# Altium schematic sheet B车模摄像头.SchDoc
size A4
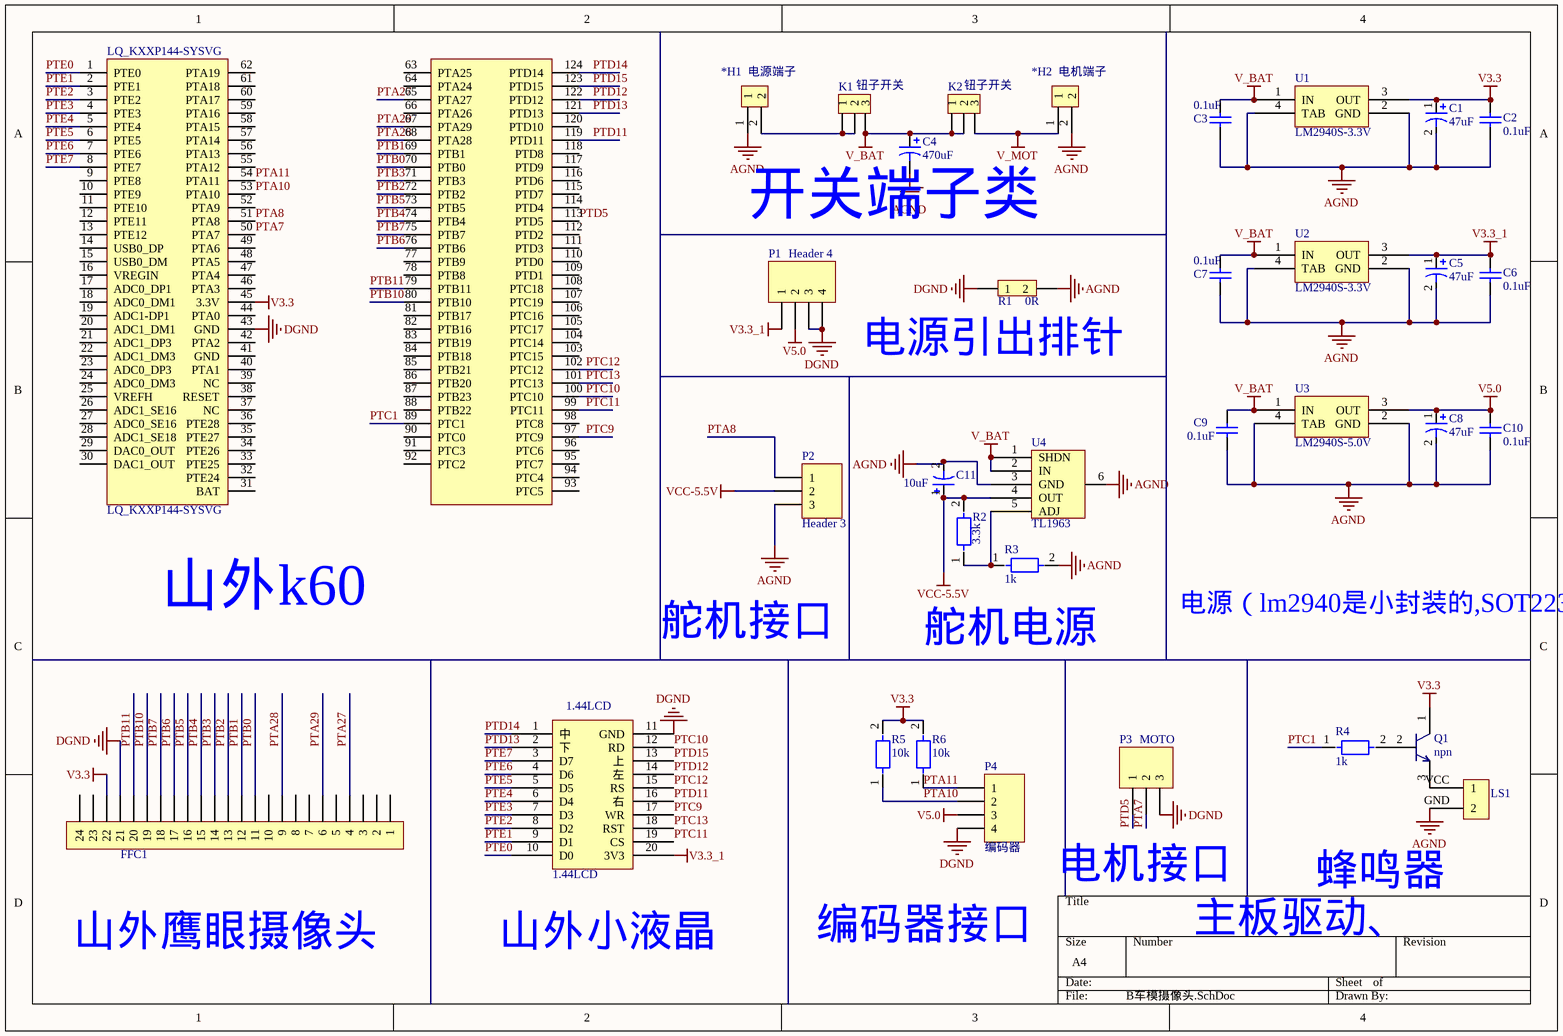
[diagram p0: B车模摄像头.SchDoc]

## Parts
1.44LCD  1.44LCD  [1.44LCD]
*H1  电源端子  [端子]
*H2  电机端子  [端子]
C1  47uF  [3216]
C2  0.1uF  [0805]
C3  0.1uF  [0805]
C4  value 470uF  [470UF]  (hidden comment: Cap Pol1)
C5  47uF  [3216]
C6  0.1uF  [0805]
C7  0.1uF  [0805]
C8  47uF  [3216]
C9  0.1uF  [0805]
C10  0.1uF  [0805]
C11  10uF  [3216]
FFC1  FFC_0.5_24  [摄像头软排]  (value not drawn)
K1  钮子开关  [钮子开关]
K2  钮子开关  [钮子开关]
LQ_KXXP144-SYSVG  LQ_KXXP144-SYSVG  [LQ_KXXP144-SYSVG]
LS1  0905小型蜂鸣器  [0905小型蜂鸣器]  (value not drawn)
P1  Header 4  [HDR1X4]
P2  Header 3  [HDR1X3]
P3  MOTO  [HDR1X3]
P4  编码器  [HDR1X4]
Q1  npn  [npn]
R1  vaul: 0R  [R-0603 - duplicate1]  (hidden comment: R-0603)
R2  3.3k  [0805]
R3  1k  [0805]
R4  1k  [0805]
R5  10k  [0805]
R6  10k  [0805]
U1  LM2940S-3.3V  [LM2940S-5.0]
U2  LM2940S-3.3V  [LM2940S-5.0]
U3  LM2940S-5.0V  [LM2940S-5.0]
U4  TL1963  [SOT223-5]

## Nets
AGND: *H1.1 *H2.2 C1.2 C2.2 C3.2 C4.2 C5.2 C6.2 C7.2 C8.2 C9.2 C10.2 C11.2 LS1.GND(2) P2.3 R1.3(2) R3.2 U1.2(GND) U1.4(TAB) U2.2(GND) U2.4(TAB) U3.2(GND) U3.4(TAB) U4.3(GND) U4.6(GND)
DGND: 1.44LCD.11(GND) FFC1.21 LQ_KXXP144-SYSVG.43(GND) P1.3 P1.4 P3.3 P4.4 R1.2(1)
V3.3: C1.1 C2.1 FFC1.22 LQ_KXXP144-SYSVG.45(3.3V) Q1.1 R5.2 R6.2 U1.3(OUT)
V3.3_1: 1.44LCD.20(3V3) C5.1 C6.1 P1.1 U2.3(OUT)
V5.0: C8.1 C10.1 P1.2 P4.3 U3.3(OUT)
V_BAT: C3.1 C4.1 C7.1 C9.1 K1.3 K2.1 K2.2 U1.1(IN) U2.1(IN) U3.1(IN) U4.1(SHDN) U4.2(IN)
V_MOT: *H2.1 K2.3
VCC-5.5V: C11.1 P2.2 R2.2 U4.4(OUT)
PTA7: LQ_KXXP144-SYSVG.50(PTA7) P3.2
PTA8: LQ_KXXP144-SYSVG.51(PTA8) P2.1
PTA10: LQ_KXXP144-SYSVG.53(PTA10) P4.2 R5.1
PTA11: LQ_KXXP144-SYSVG.54(PTA11) P4.1 R6.1
PTA27: FFC1.4 LQ_KXXP144-SYSVG.65(PTA27)
PTA28: FFC1.9 LQ_KXXP144-SYSVG.68(PTA28)
PTA29: FFC1.6 LQ_KXXP144-SYSVG.67(PTA29)
PTB0: FFC1.11 LQ_KXXP144-SYSVG.70(PTB0)
PTB1: FFC1.12 LQ_KXXP144-SYSVG.69(PTB1)
PTB2: FFC1.13 LQ_KXXP144-SYSVG.72(PTB2)
PTB3: FFC1.14 LQ_KXXP144-SYSVG.71(PTB3)
PTB4: FFC1.15 LQ_KXXP144-SYSVG.74(PTB4)
PTB5: FFC1.16 LQ_KXXP144-SYSVG.73(PTB5)
PTB6: FFC1.17 LQ_KXXP144-SYSVG.76(PTB6)
PTB7: FFC1.18 LQ_KXXP144-SYSVG.75(PTB7)
PTB10: FFC1.19 LQ_KXXP144-SYSVG.80(PTB10)
PTB11: FFC1.20 LQ_KXXP144-SYSVG.79(PTB11)
PTC1: LQ_KXXP144-SYSVG.89(PTC1) R4.1
PTC9: 1.44LCD.17(WR) LQ_KXXP144-SYSVG.97(PTC9)
PTC10: 1.44LCD.12(RD) LQ_KXXP144-SYSVG.100(PTC10)
PTC11: 1.44LCD.19(CS) LQ_KXXP144-SYSVG.99(PTC11)
PTC12: 1.44LCD.15(RS) LQ_KXXP144-SYSVG.102(PTC12)
PTC13: 1.44LCD.18(RST) LQ_KXXP144-SYSVG.101(PTC13)
PTD5: LQ_KXXP144-SYSVG.113(PTD5) P3.1
PTD11: 1.44LCD.16(右) LQ_KXXP144-SYSVG.119(PTD11)
PTD12: 1.44LCD.14(左) LQ_KXXP144-SYSVG.122(PTD12)
PTD13: 1.44LCD.2(下) LQ_KXXP144-SYSVG.121(PTD13)
PTD14: 1.44LCD.1(中) LQ_KXXP144-SYSVG.124(PTD14)
PTD15: 1.44LCD.13(上) LQ_KXXP144-SYSVG.123(PTD15)
PTE0: 1.44LCD.10(D0) LQ_KXXP144-SYSVG.1(PTE0)
PTE1: 1.44LCD.9(D1) LQ_KXXP144-SYSVG.2(PTE1)
PTE2: 1.44LCD.8(D2) LQ_KXXP144-SYSVG.3(PTE2)
PTE3: 1.44LCD.7(D3) LQ_KXXP144-SYSVG.4(PTE3)
PTE4: 1.44LCD.6(D4) LQ_KXXP144-SYSVG.5(PTE4)
PTE5: 1.44LCD.5(D5) LQ_KXXP144-SYSVG.6(PTE5)
PTE6: 1.44LCD.4(D6) LQ_KXXP144-SYSVG.7(PTE6)
PTE7: 1.44LCD.3(D7) LQ_KXXP144-SYSVG.8(PTE7)
Net*H1_2: *H1.2 K1.1 K1.2
NetLS1_VCC: LS1.VCC(1) Q1.3
NetQ1_2: Q1.2 R4.2
NetR2_1: R2.1 R3.1 U4.5(ADJ)

Not connected (* = marked no-connect by the designer): FFC1 1 2 3 5 7 8 10 23 24; LQ_KXXP144-SYSVG 9(PTE8) 10(PTE9) 11(PTE10) 12(PTE11) 13(PTE12) 14(USB0_DP) 15(USB0_DM) 16(VREGIN) 17(ADC0_DP1) 18(ADC0_DM1) 19(ADC1-DP1) 20(ADC1_DM1) 21(ADC1_DP3) 22(ADC1_DM3) 23(ADC0_DP3) 24(ADC0_DM3) 25(VREFH) 26(ADC1_SE16) 27(ADC0_SE16) 28(ADC1_SE18) 29(DAC0_OUT) 30(DAC1_OUT) 31(BAT) 32(PTE24) 33(PTE25) 34(PTE26) 35(PTE27) 36(PTE28) 37(NC) 38(RESET) 39(NC) 40(PTA1) 41(GND) 42(PTA2) 44(PTA0) 46(PTA3) 47(PTA4) 48(PTA5) 49(PTA6) 52(PTA9) 55(PTA12) 56(PTA13) 57(PTA14) 58(PTA15) 59(PTA16) 60(PTA17) 61(PTA18) 62(PTA19) 63(PTA25) 64(PTA24) 66(PTA26) 77(PTB9) 78(PTB8) 81(PTB17) 82(PTB16) 83(PTB19) 84(PTB18) 85(PTB21) 86(PTB20) 87(PTB23) 88(PTB22) 90(PTC0) 91(PTC3) 92(PTC2) 93(PTC5) 94(PTC4) 95(PTC7) 96(PTC6) 98(PTC8) 103(PTC15) 104(PTC14) 105(PTC17) 106(PTC16) 107(PTC19) 108(PTC18) 109(PTD1) 110(PTD0) 111(PTD3) 112(PTD2) 114(PTD4) 115(PTD7) 116(PTD6) 117(PTD9) 118(PTD8) 120(PTD10)

## Notes on the sheet
- Labels drawn without touching a wire or pin: 主板驱动、, 山外k60, 山外小液晶, 山外鹰眼摄像头, 开关端子类, 电机接口, 电源引出排针, 电源（lm2940是小封装的,SOT223封装）, 编码器接口, 舵机接口, 舵机电源, 蜂鸣器

## Library data of the parts
*H1 *H2 = 端子5MM
C1 C5 C8 = CAP-TAN-47uF
C2 C3 C6 C7 C9 C10 = CAP-0805_1
C4 = Cap Pol1: Polarized Capacitor (Radial); Published: 8-Jun-2000; LatestRevisionDate: 17-Jul-2002; LatestRevisionNote: Re-released for DXP Platform.; PackageReference: RB7.6-15; Publisher: Altium Limited
C11 = CAP-TAN-10uF
FFC1 = FFC_0.5_24: FFC
K1 K2 = 钮子开关: 钮子开关102
LS1 = 0905小型蜂鸣器: 0905小蜂鸣器; pin to pad: GND>2 VCC>1
P1 P4 = Header 4: Header, 4-Pin; LatestRevisionDate: 17-Jul-2002; LatestRevisionNote: Re-released for DXP Platform.; Publisher: Altium Limited
P2 P3 = Header 3: Header, 3-Pin; LatestRevisionDate: 17-Jul-2002; LatestRevisionNote: Re-released for DXP Platform.; Publisher: Altium Limited
R1 = R-0603: pin to pad: 2>1 3>2; 封装: 0603
R2-R6 = RES-0805
U1-U3 = LM2940S-5.0